# EAGLE design CAN_USB_PIC32 (EAGLE 6.4)
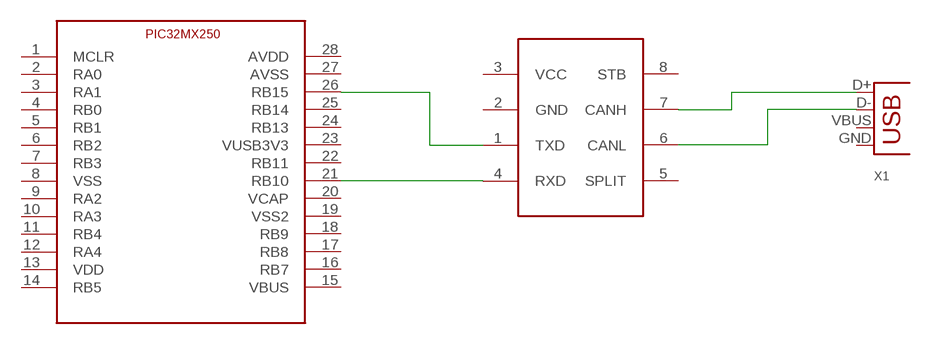
[diagram p0: schematic, sheet 1]

## Parts
U$1  TJA1040  [SOIC8-N_MC]
U$2  PIC32MX250SOIC  [SOIC28]
X1  USB-B-H  [USB-B-H]

## Nets
N$1: U$1.7(CANH) X1.D+
N$2: U$1.6(CANL) X1.D-
N$3: U$1.1(TXD) U$2.26(RB15)
N$4: U$1.4(RXD) U$2.21(RB10)
Unconnected: U$1.5(SPLIT) U$1.8(STB) U$2.1(MCLR) U$2.2(RA0) U$2.3(RA1) U$2.4(RB0) U$2.5(RB1) U$2.6(RB2) U$2.7(RB3) U$2.9(RA2) U$2.10(RA3) U$2.11(RB4) U$2.12(RA4) U$2.14(RB5) U$2.15(VBUS) U$2.16(RB7) U$2.17(RB8) U$2.18(RB9) U$2.19(VSS2) U$2.20(VCAP) U$2.22(RB11) U$2.23(VUSB3V3) U$2.24(RB13) U$2.25(RB14) U$2.27(AVSS) U$2.28(AVDD) X1.GND X1.VBUS

## Power pins joined to a net without a drawn wire
GND: U$1.2(GND)
VCC: U$1.3(VCC)
VDD: U$2.13(VDD)
VSS: U$2.8(VSS)

## Library data of the parts
U$1 = lieven:TJA1040
U$2 = lieven:PIC32MX250
X1 = lieven:USB: USB Connectors

## Board
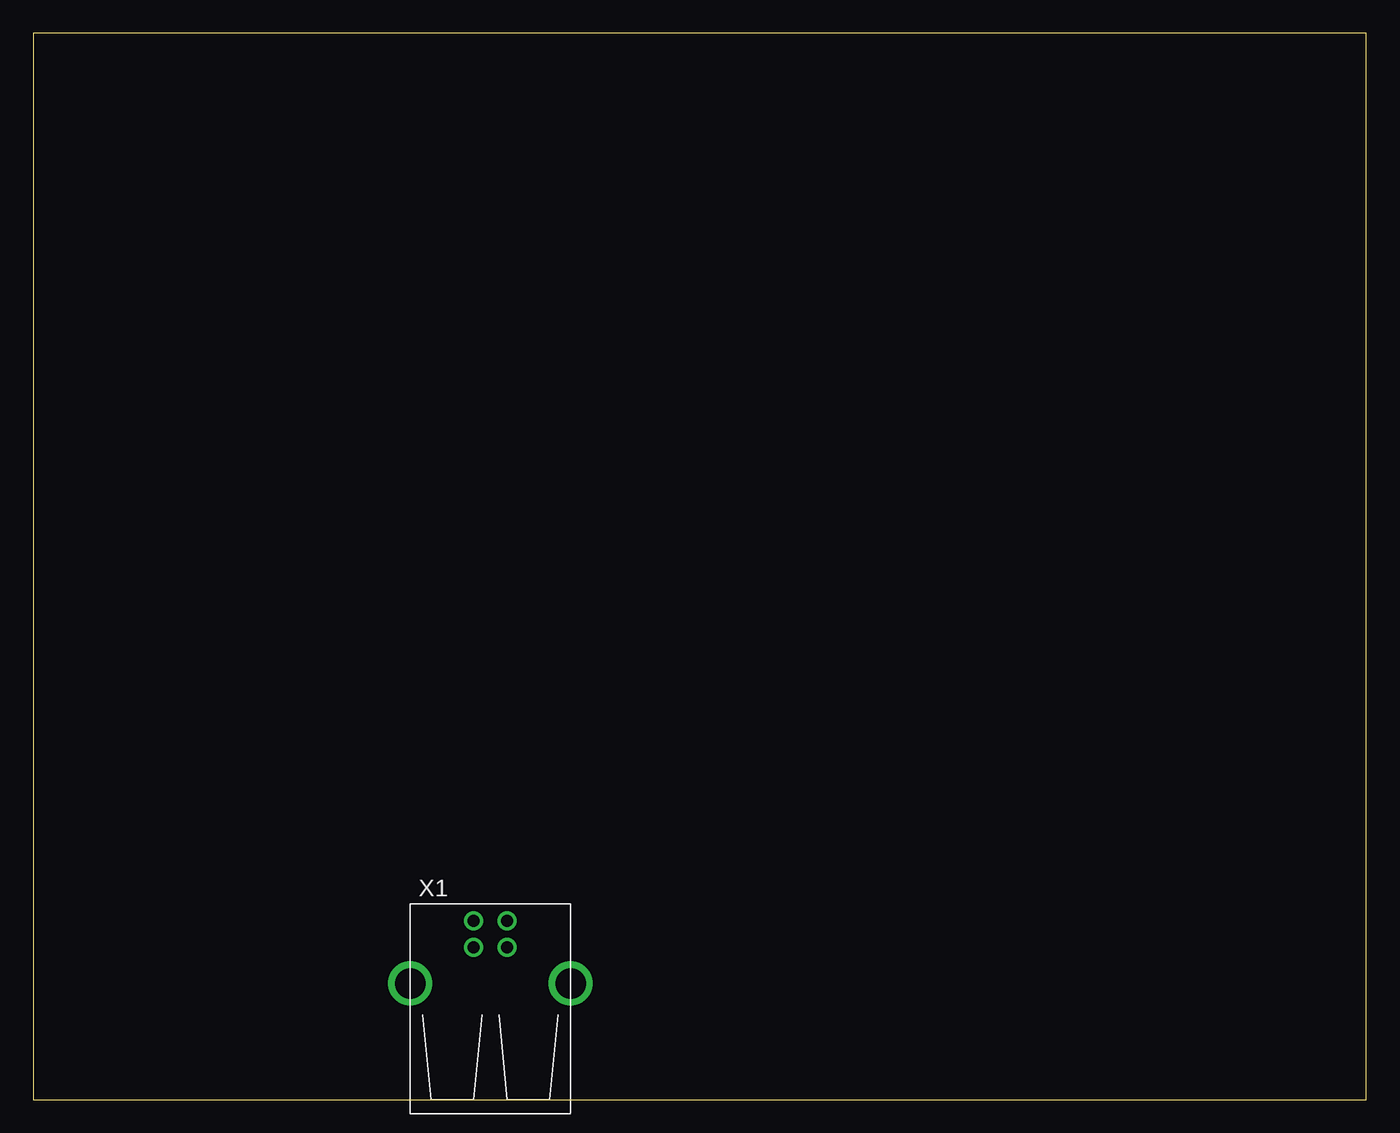
[diagram p1: board, top side]
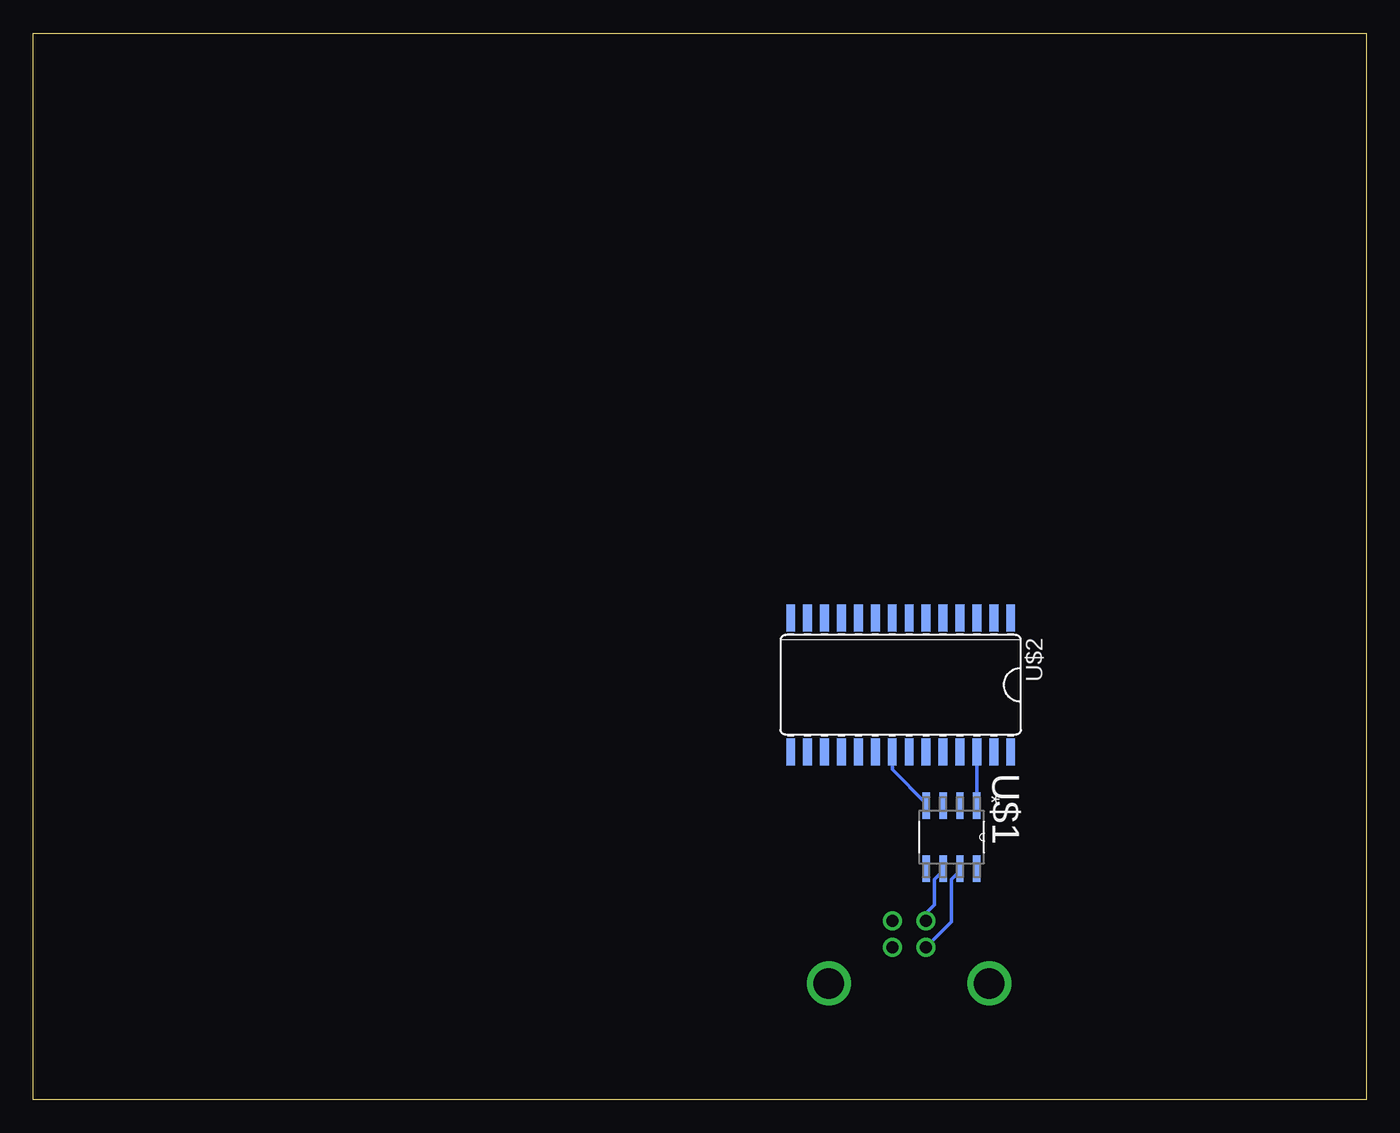
[diagram p2: board, bottom side, seen from below]

Size 100 x 80 mm. Coordinates in mm from the lower left corner, seen from the top.
Outline: 0,0 100,0 100,80 0,80 0,0
Copper layers (1*16): Top 0.035mm / dielectric 1.5mm / Bottom 0.035mm
Design rules "default": minimum track width 10mil, minimum drill 24mil, track to track 8mil, track to pad 8mil, pad to pad 8mil, via to via 8mil, smd to smd 8mil, copper to edge 40mil, drill to drill 8mil, minimum pad ring 10mil, minimum via ring 8mil, stop-mask expansion 4mil, vias tented up to drill 0mil, thermal gap 10mil

### Footprints (pad centres in the part's own frame; a part is rotated, then mirrored left to right if it is on the bottom)
SOIC8-N_MC = smd 1.981 x 0.559: 1 -2.362,1.905; 2 -2.362,0.635; 3 -2.362,-0.635; 4 -2.362,-1.905; 5 2.362,-1.905; 6 2.362,-0.635; 7 2.362,0.635; 8 2.362,1.905
SOIC28 = smd 0.66 x 2.032: 1 -6.985,-5.029; 2 -5.715,-5.029; 3 -4.445,-5.029; 4 -3.175,-5.029; 5 -1.905,-5.029; 6 -0.635,-5.029; 7 0.635,-5.029; 8 1.905,-5.029; 9 3.175,-5.029; 10 4.445,-5.029; 11 5.715,-5.029; 12 6.985,-5.029; 13 8.255,-5.029; 14 9.525,-5.029; 15 9.525,5.029; 16 8.255,5.029; 17 6.985,5.029; 18 5.715,5.029; 19 4.445,5.029; 20 3.175,5.029; 21 1.905,5.029; 22 0.635,5.029; 23 -0.635,5.029; 24 -1.905,5.029; 25 -3.175,5.029; 26 -4.445,5.029; 27 -5.715,5.029; 28 -6.985,5.029
USB-B-H = drill 0.914: D+ 0,1.25; D- 1.981,1.25; GND 0,-1.25; VBUS 1.981,-1.25 | drill 2.286: P$1 -2.718,-6.02; P$2 -2.718,6.02

### Placement (x,y rotation side)
U$1  31.11,19.68 270 bottom
U$2  33.66,31.11 180 bottom
X1  34.29,11.43 90 top

### Tracks (layer width: path | path; a pad name or v marks a point on that pad's centre or on a via)
N$1
  Bottom 0.254: U$1.7 30.48,17.14 31.11,16.51 31.11,13.34 33.02,11.43 X1.D+
N$2
  Bottom 0.254: U$1.6 31.75,17.14 32.38,16.51 32.38,14.61 33.02,13.97 X1.D-
N$3
  Bottom 0.254: U$2.26 U$1.1
N$4
  Bottom 0.254: U$2.21 35.56,24.77 33.02,22.23 U$1.4